# Altium schematic sheet connectors.SchDoc
size A; SheetNumber: 3; SheetTotal: 3
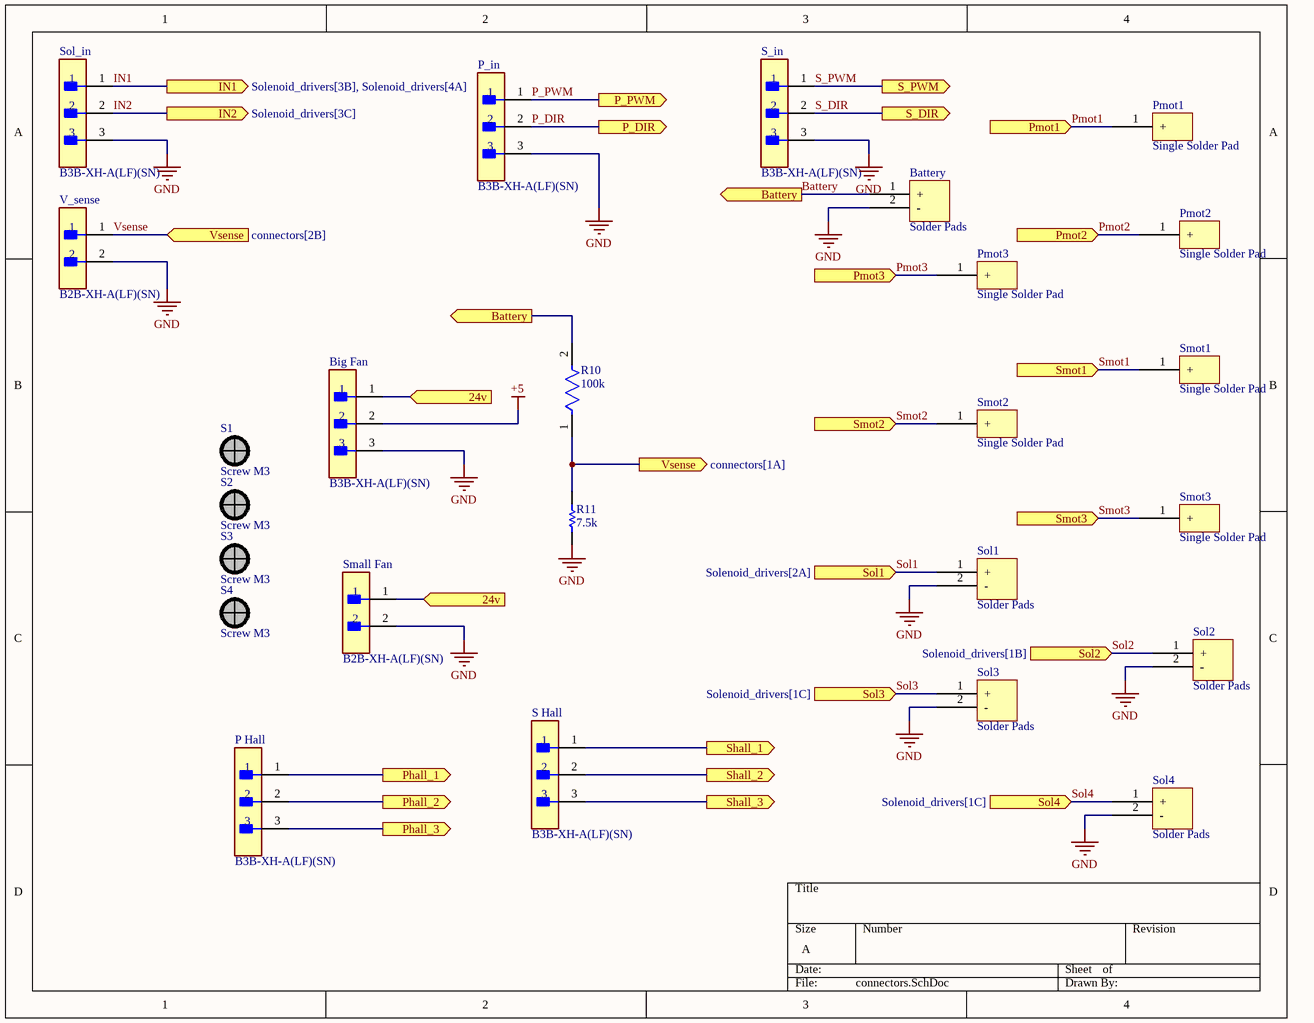
[diagram p0: connectors.SchDoc]

## Parts
Battery  Solder Pads  [Solder Pad]
Big_Fan  B3B-XH-A(LF)(SN)  [FP-B3B-XH-A_LF_SN-MFG]
P_Hall  B3B-XH-A(LF)(SN)  [FP-B3B-XH-A_LF_SN-MFG]
P_in  B3B-XH-A(LF)(SN)  [FP-B3B-XH-A_LF_SN-MFG]
Pmot1  Single Solder Pad  [SOLDER PAD SINGLE]
Pmot2  Single Solder Pad  [SOLDER PAD SINGLE]
Pmot3  Single Solder Pad  [SOLDER PAD SINGLE]
R10  100k  [FP-CR0805-MFG]
R11  7.5k  [RESC2013X70X40LL20T20]
S1  Screw M3  [Screw M3]
S2  Screw M3  [Screw M3]
S3  Screw M3  [Screw M3]
S4  Screw M3  [Screw M3]
S_Hall  B3B-XH-A(LF)(SN)  [FP-B3B-XH-A_LF_SN-MFG]
S_in  B3B-XH-A(LF)(SN)  [FP-B3B-XH-A_LF_SN-MFG]
Small_Fan  B2B-XH-A(LF)(SN)  [FP-B2B-XH-A_LF_SN-MFG]
Smot1  Single Solder Pad  [SOLDER PAD SINGLE]
Smot2  Single Solder Pad  [SOLDER PAD SINGLE]
Smot3  Single Solder Pad  [SOLDER PAD SINGLE]
Sol1  Solder Pads  [Solder Pad]
Sol2  Solder Pads  [Solder Pad]
Sol3  Solder Pads  [Solder Pad]
Sol4  Solder Pads  [Solder Pad]
Sol_in  B3B-XH-A(LF)(SN)  [FP-B3B-XH-A_LF_SN-MFG]
V_sense  B2B-XH-A(LF)(SN)  [FP-B2B-XH-A_LF_SN-MFG]

## Ports
24v (in, see connectors[2B], PandMshem[1B], PandMshem[1C], PandMshem[3A]), 24v (in, see connectors[2C], PandMshem[1B], PandMshem[1C], PandMshem[3A]), Battery (out, see connectors[2B], PandMshem[1A], PandMshem[3B], Solenoid_drivers[1B], Solenoid_drivers[1C], Solenoid_drivers[1D], Solenoid_drivers[2A]), Battery (out, see connectors[3A], PandMshem[1A], PandMshem[3B], Solenoid_drivers[1B], Solenoid_drivers[1C], Solenoid_drivers[1D], Solenoid_drivers[2A]), IN1 (out, see Solenoid_drivers[3B], Solenoid_drivers[4A]), IN2 (out, see Solenoid_drivers[3C]), P_DIR (out, see PandMshem[3B]), P_PWM (out, see PandMshem[3B]), Phall_1 (out, see PandMshem[1B]), Phall_2 (out, see PandMshem[1C]), Phall_3 (out, see PandMshem[3B]), Pmot1 (in, see PandMshem[1B]), Pmot2 (in, see PandMshem[1B]), Pmot3 (in, see PandMshem[1B]), S_DIR (out, see PandMshem[3C]), S_PWM (out, see PandMshem[3C]), Shall_1 (out, see PandMshem[1C]), Shall_2 (out, see PandMshem[1D]), Shall_3 (out, see PandMshem[3C]), Smot1 (in, see PandMshem[1C]), Smot2 (in, see PandMshem[1C]), Smot3 (in, see PandMshem[1C]), Sol1 (in, see Solenoid_drivers[2A]), Sol2 (in, see Solenoid_drivers[1B]), Sol3 (in, see Solenoid_drivers[1C]), Sol4 (in, see Solenoid_drivers[1C]), Vsense (in, see connectors[2B]), Vsense (out, see connectors[1A])

## Nets
+5: Big_Fan.2
GND: Battery.2(-) Big_Fan.3 P_in.3 R11.1 S_in.3 Small_Fan.2 Sol1.2(-) Sol2.2(-) Sol3.2(-) Sol4.2(-) Sol_in.3 V_sense.2
24v: Big_Fan.1 Small_Fan.1 ; port 24v
Battery: Battery.1(+) R10.2 ; port Battery
IN1: Sol_in.1 ; port IN1
IN2: Sol_in.2 ; port IN2
P_DIR: P_in.2 ; port P_DIR
P_PWM: P_in.1 ; port P_PWM
Phall_1: P_Hall.1 ; port Phall_1
Phall_2: P_Hall.2 ; port Phall_2
Phall_3: P_Hall.3 ; port Phall_3
Pmot1: Pmot1.1(+) ; port Pmot1
Pmot2: Pmot2.1(+) ; port Pmot2
Pmot3: Pmot3.1(+) ; port Pmot3
S_DIR: S_in.2 ; port S_DIR
S_PWM: S_in.1 ; port S_PWM
Shall_1: S_Hall.1 ; port Shall_1
Shall_2: S_Hall.2 ; port Shall_2
Shall_3: S_Hall.3 ; port Shall_3
Smot1: Smot1.1(+) ; port Smot1
Smot2: Smot2.1(+) ; port Smot2
Smot3: Smot3.1(+) ; port Smot3
Sol1: Sol1.1(+) ; port Sol1
Sol2: Sol2.1(+) ; port Sol2
Sol3: Sol3.1(+) ; port Sol3
Sol4: Sol4.1(+) ; port Sol4
Vsense: R10.1 R11.2 V_sense.1 ; port Vsense

## Library data of the parts
Battery Sol1-Sol4 = Component_1
Big_Fan P_Hall P_in S_Hall S_in Sol_in = CMP-17439-000014-3: CONN HEADER VERT 3POS 2.5MM; Max Voltage Rating (DC): 250V; Number of Positions: 3; Current Rating: 3A; Gender: Male; Wire/Cable Gauge: 22AWG; Contact Resistance: 20mR; Insulation Resistance: 1GR; Insulation Material: Nylon; Contact Plating: Tin; Depth: 5.75mm; Contact Type: Male Pin; Max Operating Temperature: 85°C; Insulation Color: Natural; Voltage Rating (AC): 250V; Color: Natural; Connector Type: Header; Orientation: Straight; Fastening Type: Detent; Housing Color: White; Min Operating Temperature: -25°C; Termination: Solder; Voltage Rating: 250V; Series: XH; Pitch: 2.5mm; Contact Shape: Square; Number of Rows: 1; Lead Free: Lead Free; Packaging: Bulk; Mount: Through Hole; Flammability Rating: UL94 V-0; Max Voltage Rating (AC): 250V; REACH SVHC: No SVHC; Housing Material: Polyamide; Contact Material: Brass; Lead Pitch: 2.5mm; Contact Finish - Mating: TIN; Length: 9.9mm; Max Current Rating: 3A; Number of Contacts: 3
Pmot1-Pmot3 Smot1-Smot3 = singlesolpad_1
R10 = CMP-07231-001707-1: Thick Film Chip Resistors 0805 100kΩ 0.125W 5% 200ppm/°C CR0805-JW-104GLF; Power Rating: 125mW; Voltage Rating: 150V; Resistance: 100kR; Case Code (Metric): 2012; Case Code (Imperial): 0805; Temperature Coefficient: 200ppm/°C; Mount: Surface Mount; Tolerance: 5%; Radiation Hardening: No; Military Standard: Not; Contact Plating: Tin; Number of Terminations: 2; Packaging: Tape and Reel; Thickness: 508um; Length: 0.079inch; Depth: 1.25mm; Min Operating Temperature: -55°C; Features: Moisture Resistant; Max Operating Temperature: 155°C; Width: 0.049inch; Package Quantity: 10000; Termination: SMD/SMT; Composition: Thick Film; Max Power Dissipation: 125mW; Height: 0.024inch; Case/Package: 0805
R11 = CMP-2001-00447-1: ERJ-6GEYJ752V; Manufacturer: Panasonic; Part Number: ERJ-6GEYJ752V
Small_Fan V_sense = CMP-2000-05888-3: CONN HEADER VERT 2POS 2.5MM; Current Rating: 3A; Voltage Rating: 250V; Number of Contacts: 2; Contact Resistance: 20mR; Wire/Cable Gauge: 22AWG; Insulation Resistance: 1GR; Connector Type: Male Pin; Packaging: Bulk; Contact Material: Brass; Lead Free: Lead Free; Orientation: Straight; Contact Plating: Tin; Max Current Rating: 3A; Termination: Solder; Fastening Type: Detent; Depth: 5.75mm; Housing Material: Polyamide; REACH SVHC: No SVHC; Series: XH; Voltage Rating (AC): 250V; Number of Positions: 2; Color: Natural; Contact Type: Male Pin; Max Voltage Rating (DC): 250V; Pitch: 2.5mm; Lead Pitch: 2.5mm; Mount: Through Hole; Max Operating Temperature: 85°C; Length: 7.4mm; Max Voltage Rating (AC): 250V; Min Operating Temperature: -25°C; Number of Rows: 1; Housing Color: White